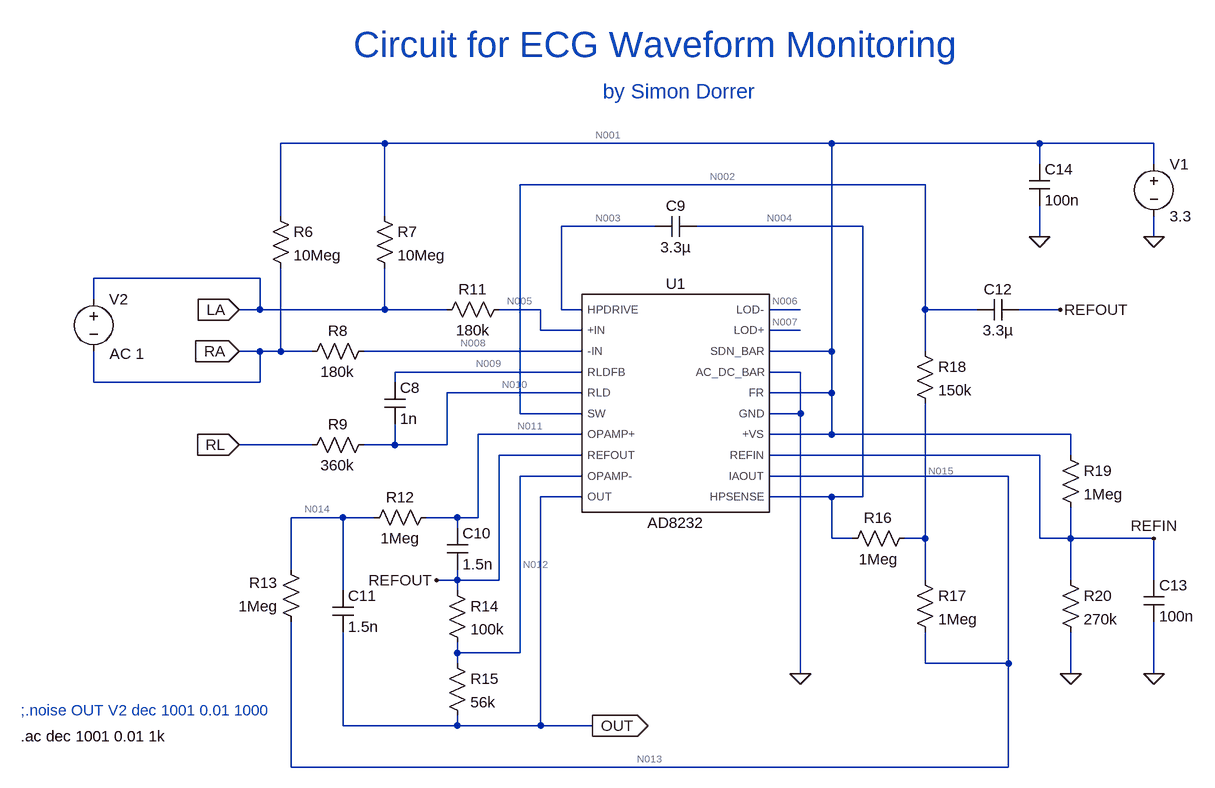
[diagram p0: schematic AD8232.asc]
AD8232.asc, the LTspice schematic file:
Version 4
SHEET 1 1480 752
WIRE -192 -304 -352 -304
WIRE 496 -304 -192 -304
WIRE 816 -304 496 -304
WIRE 992 -304 816 -304
WIRE 816 -272 816 -304
WIRE 992 -272 992 -304
WIRE 640 -240 16 -240
WIRE -352 -192 -352 -304
WIRE -192 -192 -192 -304
WIRE 224 -176 80 -176
WIRE 544 -176 288 -176
WIRE 816 -160 816 -208
WIRE 992 -160 992 -192
WIRE -384 -96 -640 -96
WIRE -640 -64 -640 -96
WIRE -384 -48 -384 -96
WIRE -384 -48 -416 -48
WIRE -192 -48 -192 -112
WIRE -192 -48 -384 -48
WIRE -96 -48 -192 -48
WIRE 48 -48 -16 -48
WIRE 80 -48 80 -176
WIRE 112 -48 80 -48
WIRE 448 -48 400 -48
WIRE 640 -48 640 -240
WIRE 720 -48 640 -48
WIRE 848 -48 784 -48
WIRE 48 -16 48 -48
WIRE 112 -16 48 -16
WIRE 448 -16 400 -16
WIRE -384 16 -416 16
WIRE -352 16 -352 -112
WIRE -352 16 -384 16
WIRE -304 16 -352 16
WIRE 112 16 -224 16
WIRE 496 16 496 -304
WIRE 496 16 400 16
WIRE 640 16 640 -48
WIRE 112 48 -176 48
WIRE 448 48 400 48
WIRE -640 64 -640 16
WIRE -384 64 -384 16
WIRE -384 64 -640 64
WIRE -176 64 -176 48
WIRE 112 80 -96 80
WIRE 496 80 496 16
WIRE 496 80 400 80
WIRE 16 112 16 -240
WIRE 112 112 16 112
WIRE 448 112 448 48
WIRE 448 112 400 112
WIRE 112 144 -48 144
WIRE 496 144 496 80
WIRE 496 144 400 144
WIRE 864 144 496 144
WIRE -304 160 -416 160
WIRE -176 160 -176 128
WIRE -176 160 -224 160
WIRE -96 160 -96 80
WIRE -96 160 -176 160
WIRE 112 176 -16 176
WIRE 816 176 400 176
WIRE 864 176 864 144
WIRE 112 208 16 208
WIRE 768 208 400 208
WIRE 112 240 48 240
WIRE 496 240 400 240
WIRE 544 240 544 -176
WIRE 544 240 496 240
WIRE -256 272 -336 272
WIRE -208 272 -256 272
WIRE -80 272 -128 272
WIRE -48 272 -48 144
WIRE -48 272 -80 272
WIRE -80 288 -80 272
WIRE 496 304 496 240
WIRE 528 304 496 304
WIRE 640 304 640 96
WIRE 640 304 608 304
WIRE 816 304 816 176
WIRE 864 304 864 256
WIRE 864 304 816 304
WIRE 992 304 864 304
WIRE -336 352 -336 272
WIRE -80 368 -80 352
WIRE -80 368 -112 368
WIRE -16 368 -16 176
WIRE -16 368 -80 368
WIRE 640 368 640 304
WIRE 864 368 864 304
WIRE 992 368 992 304
WIRE -256 384 -256 272
WIRE -80 384 -80 368
WIRE -80 480 -80 464
WIRE 16 480 16 208
WIRE 16 480 -80 480
WIRE -80 496 -80 480
WIRE 640 496 640 448
WIRE 768 496 768 208
WIRE 768 496 640 496
WIRE 448 512 448 112
WIRE 864 512 864 448
WIRE 992 512 992 432
WIRE -256 592 -256 448
WIRE -80 592 -80 576
WIRE -80 592 -256 592
WIRE 48 592 48 240
WIRE 48 592 -80 592
WIRE 128 592 48 592
WIRE -336 656 -336 432
WIRE 768 656 768 496
WIRE 768 656 -336 656
FLAG -416 -48 LA
IOPIN -416 -48 In
FLAG -416 16 RA
IOPIN -416 16 In
FLAG -416 160 RL
IOPIN -416 160 In
FLAG 128 592 OUT
IOPIN 128 592 Out
FLAG 448 512 0
FLAG 864 512 0
FLAG 992 512 0
FLAG -112 368 REFOUT
FLAG 848 -48 REFOUT
FLAG 992 -160 0
FLAG 816 -160 0
FLAG 992 304 REFIN
SYMBOL res 0 -64 R90
WINDOW 0 0 56 VBottom 2
WINDOW 3 32 56 VTop 2
SYMATTR InstName R11
SYMATTR Value 180k
SYMBOL res -208 0 R90
WINDOW 0 0 56 VBottom 2
WINDOW 3 32 56 VTop 2
SYMATTR InstName R8
SYMATTR Value 180k
SYMBOL res -208 -208 R0
SYMATTR InstName R7
SYMATTR Value 10Meg
SYMBOL res -368 -208 R0
SYMATTR InstName R6
SYMATTR Value 10Meg
SYMBOL res -208 144 R90
WINDOW 0 0 56 VBottom 2
WINDOW 3 32 56 VTop 2
SYMATTR InstName R9
SYMATTR Value 360k
SYMBOL res -96 368 R0
SYMATTR InstName R14
SYMATTR Value 100k
SYMBOL res -96 480 R0
SYMATTR InstName R15
SYMATTR Value 56k
SYMBOL cap -192 64 R0
SYMATTR InstName C8
SYMATTR Value 1n
SYMBOL cap 288 -192 R90
WINDOW 0 0 32 VBottom 2
WINDOW 3 32 32 VTop 2
SYMATTR InstName C9
SYMATTR Value 3.3µ
SYMBOL cap -272 384 R0
SYMATTR InstName C11
SYMATTR Value 1.5n
SYMBOL cap -96 288 R0
SYMATTR InstName C10
SYMATTR Value 1.5n
SYMBOL res -112 256 R90
WINDOW 0 0 56 VBottom 2
WINDOW 3 32 56 VTop 2
SYMATTR InstName R12
SYMATTR Value 1Meg
SYMBOL res -320 448 R180
WINDOW 0 36 76 Left 2
WINDOW 3 36 40 Left 2
SYMATTR InstName R13
SYMATTR Value 1Meg
SYMBOL res 848 160 R0
SYMATTR InstName R19
SYMATTR Value 1Meg
SYMBOL res 848 352 R0
SYMATTR InstName R20
SYMATTR Value 270k
SYMBOL cap 976 368 R0
SYMATTR InstName C13
SYMATTR Value 100n
SYMBOL cap 784 -64 R90
WINDOW 0 0 32 VBottom 2
WINDOW 3 32 32 VTop 2
SYMATTR InstName C12
SYMATTR Value 3.3µ
SYMBOL res 624 352 R0
SYMATTR InstName R17
SYMATTR Value 1Meg
SYMBOL res 624 0 R0
SYMATTR InstName R18
SYMATTR Value 150k
SYMBOL res 624 288 R90
WINDOW 0 0 56 VBottom 2
WINDOW 3 32 56 VTop 2
SYMATTR InstName R16
SYMATTR Value 1Meg
SYMBOL voltage 992 -288 R0
WINDOW 123 0 0 Left 0
WINDOW 39 0 0 Left 0
SYMATTR InstName V1
SYMATTR Value 3.3
SYMBOL cap 800 -272 R0
SYMATTR InstName C14
SYMATTR Value 100n
SYMBOL AD8232 256 96 R0
SYMATTR InstName U1
SYMBOL voltage -640 -80 R0
WINDOW 123 25 100 Left 2
WINDOW 39 0 0 Left 0
SYMATTR Value2 AC 1
SYMATTR InstName V2
SYMATTR Value ""
TEXT -240 -456 Left 5 ;Circuit for ECG Waveform Monitoring
TEXT 144 -384 Left 3 ;by Simon Dorrer
TEXT -752 608 Left 2 !.ac dec 1001 0.01 1k
TEXT -752 568 Left 2 ;;.noise OUT V2 dec 1001 0.01 1000

The netlist it stands for:
* AD8232.asc
R11 N005 LA 180k
R8 N008 RA 180k
R7 N001 LA 10Meg
R6 N001 RA 10Meg
R9 N010 RL 360k
R14 REFOUT N012 100k
R15 N012 OUT 56k
C8 N009 N010 1n
C9 N004 N003 3.3µ
C11 N014 OUT 1.5n
C10 N011 REFOUT 1.5n
R12 N011 N014 1Meg
R13 N013 N014 1Meg
R19 N001 REFIN 1Meg
R20 REFIN 0 270k
C13 REFIN 0 100n
C12 REFOUT N002 3.3µ
R17 N015 N013 1Meg
R18 N002 N015 150k
R16 N015 N004 1Meg
V1 N001 0 3.3
C14 N001 0 100n
XU1 N003 N005 N008 N009 N010 N002 N011 REFOUT N012 OUT N006 N007 N001 0 N001 0 N001 REFIN N013 N004 AD8232  ; pins HPDRIVE +IN -IN RLDFB RLD SW OPAMP+ REFOUT OPAMP- OUT LOD- LOD+ SDN_BAR AC_DC_BAR FR GND +VS REFIN IAOUT HPSENSE
V2 LA RA AC 1
* Circuit for ECG Waveform Monitoring
* by Simon Dorrer
.ac dec 1001 0.01 1k
* ;.noise OUT V2 dec 1001 0.01 1000
.lib C:\Simon Dorrer\JKU-Linz\Master\Semester 2\Master-Thesis\PCB-Design\TBS_Analog_Front-End\TBS_Analog_Front-End_LTspice\AD8232.cir
.backanno
.end

* Results of the author's LTspice run, read from the files saved beside the schematic
* Operating Point, zero values left out:
*   V(n005) = 3.3 V
*   V(la) = 3.3 V
*   V(n008) = 3.3 V
*   V(ra) = 3.3 V
*   V(n001) = 3.3 V
*   V(n010) = 117 mV
*   V(rl) = 117 mV
*   V(refout) = 700.6 mV
*   V(n012) = 588.2 mV
*   V(out) = 525.3 mV
*   V(n009) = 3.297 V
*   V(n004) = 700.5 mV
*   V(n003) = 696.9 mV
*   V(n014) = 589.3 mV
*   V(n011) = 589.2 mV
*   V(n013) = 589.3 mV
*   V(refin) = 701.6 mV
*   V(n002) = 717.2 mV
*   V(n015) = 700.5 mV
*   V(n006) = 1.829 V
*   V(n007) = 1.829 V
*   I(R11) = 50 pA
*   I(R8) = -50 pA
*   I(R14) = 1.123 µA
*   I(R15) = 1.123 µA
*   I(R12) = -50 pA
*   I(R13) = 50 pA
*   I(R19) = 2.598 µA
*   I(R20) = 2.598 µA
*   I(R17) = 111.2 nA
*   I(R18) = 111.2 nA
*   I(V1) = -172.9 µA
*   I(V2) = 50 pA